# EAGLE design M1553io (EAGLE 9.0.0)
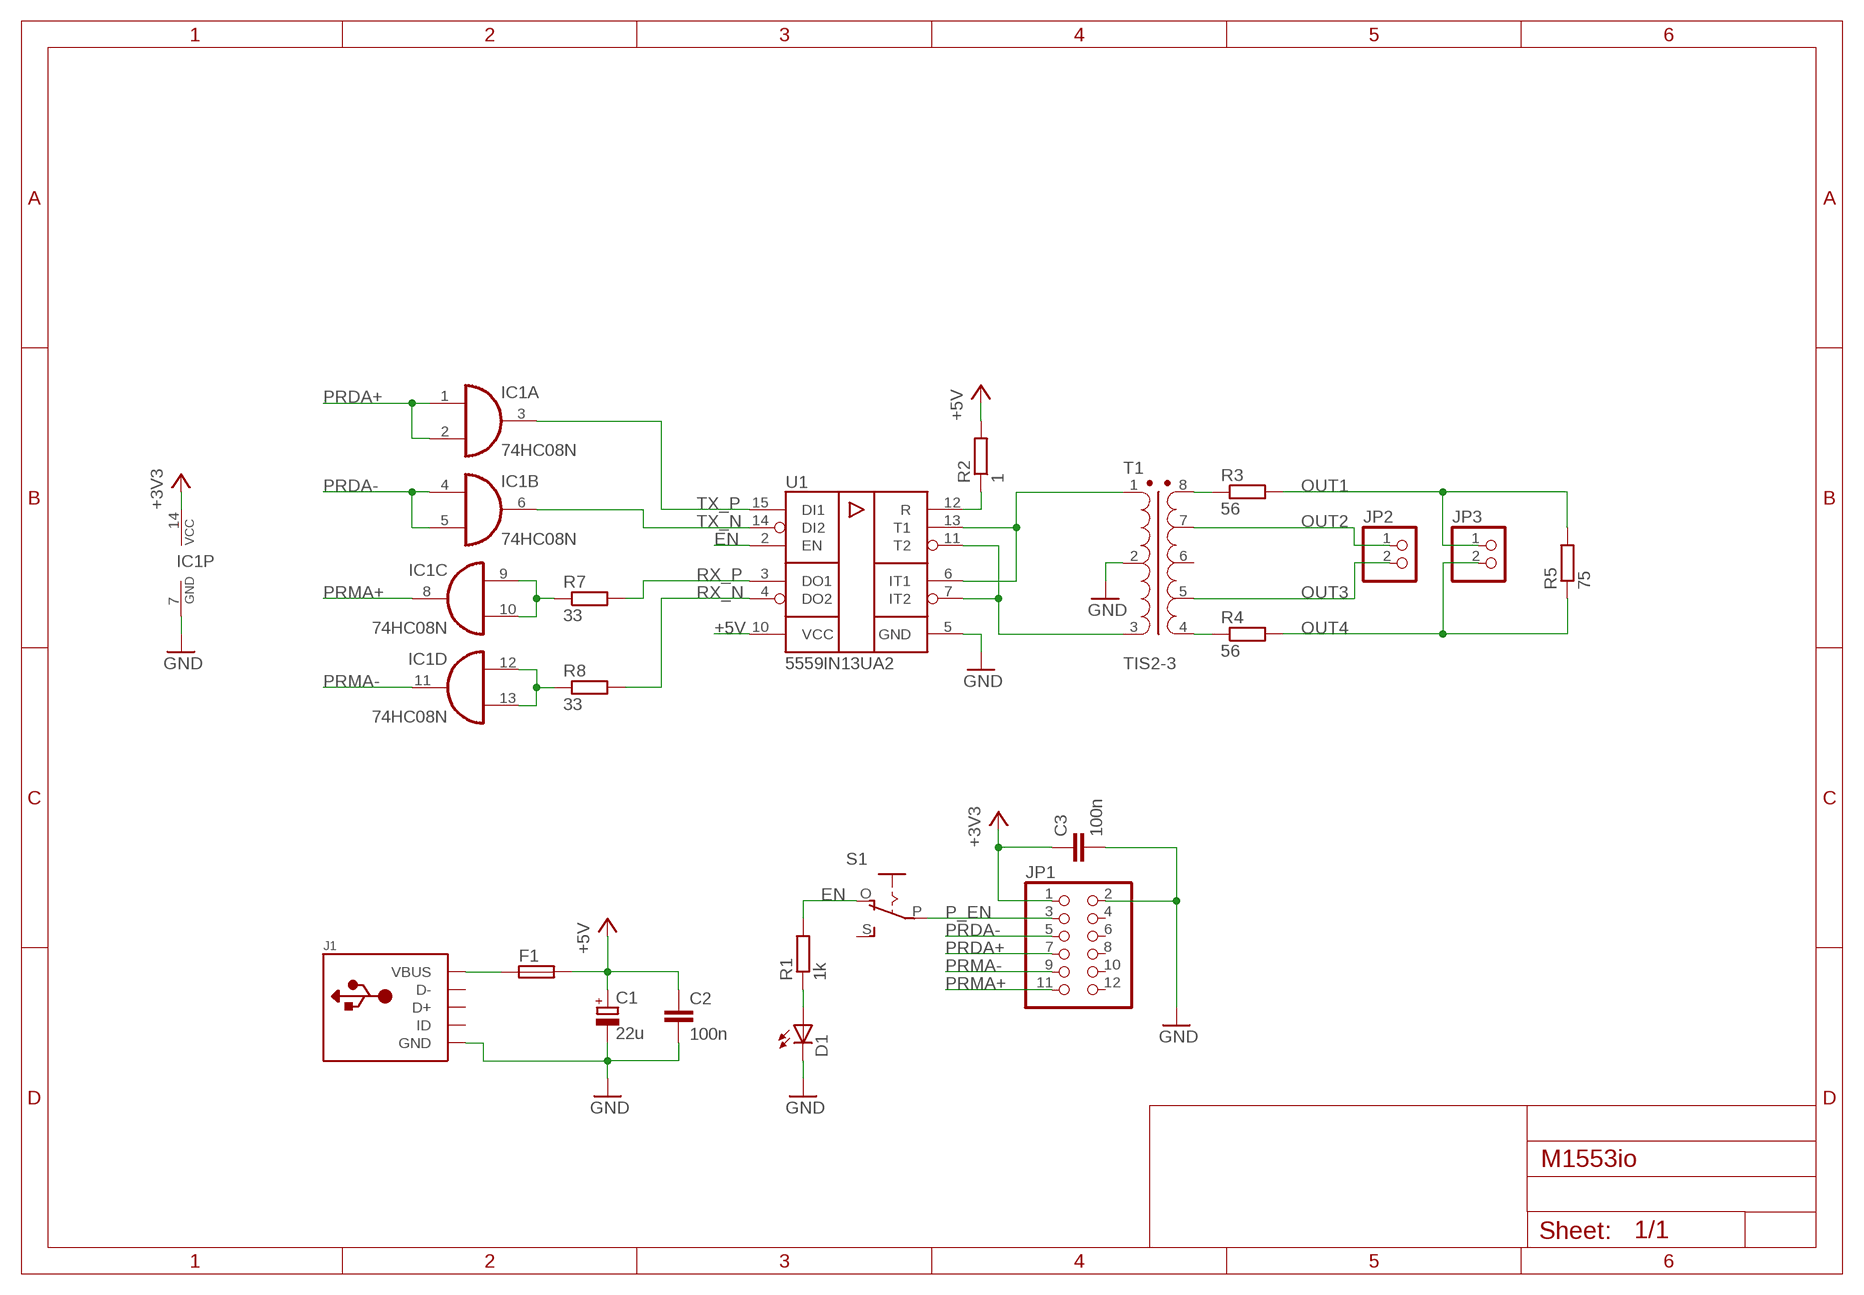
[diagram p0: schematic, sheet 1]

## Parts
C1  22u  CPOL-EU  [RCL-1206F-POL]
C2  100n  C-EU1206  [RCL-1206F]
C3  100n  C-EU1206  [RCL-1206F]
D1  LED1206  [LED-1206F]
F1  FUSE-NSMF  [RCL-1206F]
IC1  74HC08N  [DIL14]
J1  USB-MINI  [USB-MINIB]
JP1  PINHD-2X6  [2X06]
JP2  PINHD-1X2  [1X02]
JP3  PINHD-1X2  [1X02]
R1  1k  R-EU0805  [RCL-0805F]
R2  1  R-EU0805  [RCL-0805F]
R3  56  R-EU0805  [RCL-0805F]
R4  56  R-EU0805  [RCL-0805F]
R5  75  R-EU0805  [RCL-0805F]
R7  33  R-EU0805  [RCL-0805F]
R8  33  R-EU0805  [RCL-0805F]
S1  EG1218S  [EG1218]
T1  TIS2-3  [TIS2-3]
U1  5559IN13UA2  [5119.16-A]

## Nets
+3V3: C3.1 IC1.14(P:VCC) JP1.1
+5V: C1.+ C2.1 F1.2 R2.2 U1.10(VCC)
EN: R1.2 S1.O U1.2(EN)
GND: C1.- C2.2 C3.2 D1.C IC1.7(P:GND) J1.GND JP1.2 T1.2 U1.5(GND)
N$1: R3.1 T1.8
N$2: R4.1 T1.4
N$3: R2.1 U1.12(R)
N$14: F1.1 J1.VBUS
N$15: D1.A R1.1
N$16: IC1.9(C:I0) IC1.10(C:I1) R7.1
N$18: IC1.12(D:I0) IC1.13(D:I1) R8.1
OUT1: JP3.1 R3.2 R5.2
OUT2: JP2.1 T1.7
OUT3: JP2.2 T1.5
OUT4: JP3.2 R4.2 R5.1
P_EN: JP1.3 S1.P
PRDA+: IC1.1(A:I0) IC1.2(A:I1) JP1.7
PRDA-: IC1.4(B:I0) IC1.5(B:I1) JP1.5
PRMA+: IC1.8(C:O) JP1.11
PRMA-: IC1.11(D:O) JP1.9
RX_N: R8.2 U1.4(DO2)
RX_P: R7.2 U1.3(DO1)
T1: T1.1 U1.6(IT1) U1.13(T1)
T2: T1.3 U1.7(IT2) U1.11(T2)
TX_N: IC1.6(B:O) U1.14(DI2)
TX_P: IC1.3(A:O) U1.15(DI1)
Unconnected: J1.D+ J1.D- J1.ID JP1.4 JP1.6 JP1.8 JP1.10 JP1.12 S1.S T1.6

## Library data of the parts
C1 = MakBit:CPOL-EU: Polarized capacitor Tantalum SMD 3215, Electrolytic D: 5mm (10uF 50V), 6mm (100uF 9V), 7mm, 10mm (10uF 400V), 13mm (22uF 400V)
C2 C3 = MakBit:C-EU: SMD & PTH Capacitor
D1 = MakBit:LED: LEDs Standard schematic elements and footprints for 5mm, 3mm, 1206 LEDs.
F1 = MakBit:FUSE-NSMF: Bourns MF-NSMF Series - PRC Resettable Fuses USB port protection - USB 2.0, 3.0 HDMI 1.4 Source protection PC motherboards - Plug and Play protection Mobile phones - Battery and port protection PDAs / digital cameras
IC1 = 74xx-eu:74*08: Quad 2-input AND gate
J1 = MakBit:USB-MINI: USB Mini-B SMD Connector
JP1 = pinhead:PINHD-2X6: PIN HEADER
JP2 JP3 = pinhead:PINHD-1X2: PIN HEADER
R1-R5 R7 R8 = MakBit:R-EU: SMD & Through-hole Resistor
S1 = MakBit:EG1218: SLIDING SWITCH 0.1" spacing through hole, vertical SPDT slide switch http://www.ladyada.net/library/pcb/eaglelibrary.html
T1 = 5559:TIS2-3: Transformer TIS2-3 ТИС предназначен для применения в системах передачи данных и информации на базе стандартных интерфейсов цифровых сетей по ГОСТ Р 52070-2003 (MIL_STD_1553). More info here <http://mstator.ru/products/pulse_transformers/tis>
U1 = 5559:5559IN13UA2: 5559ИН13УА2

## Board
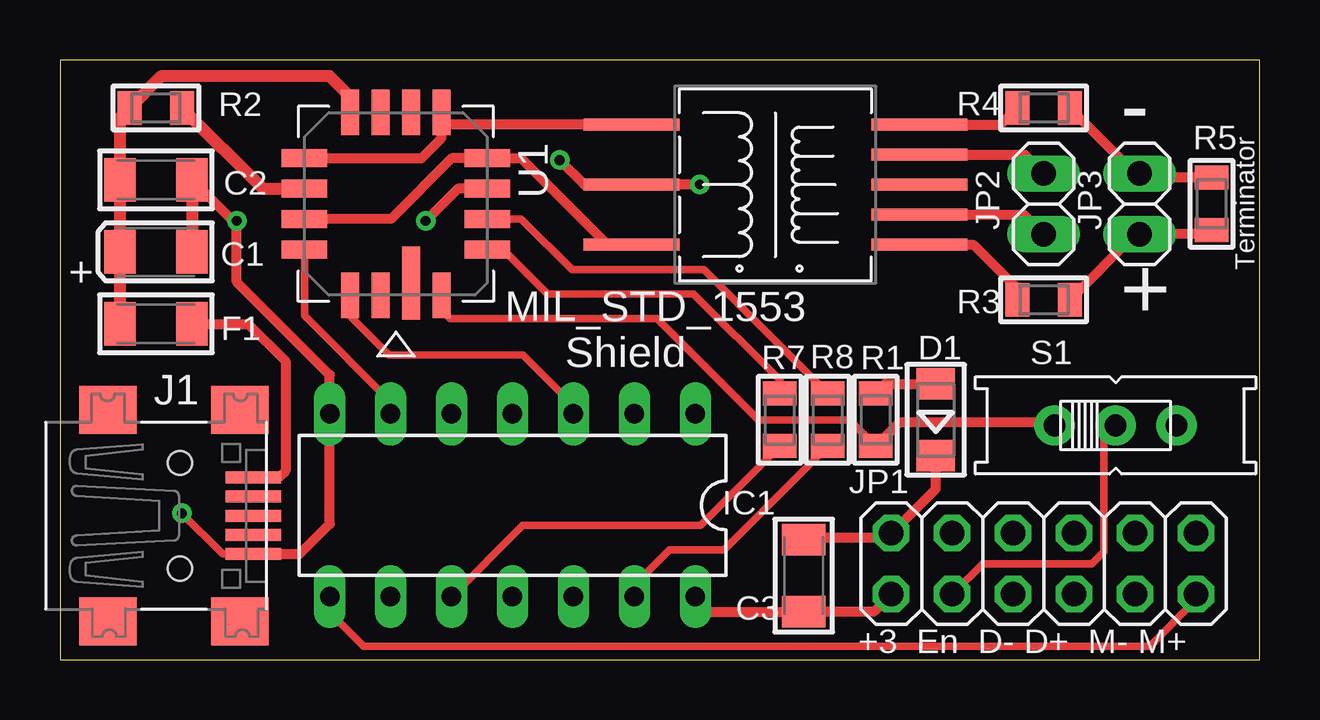
[diagram p1: board, top side]
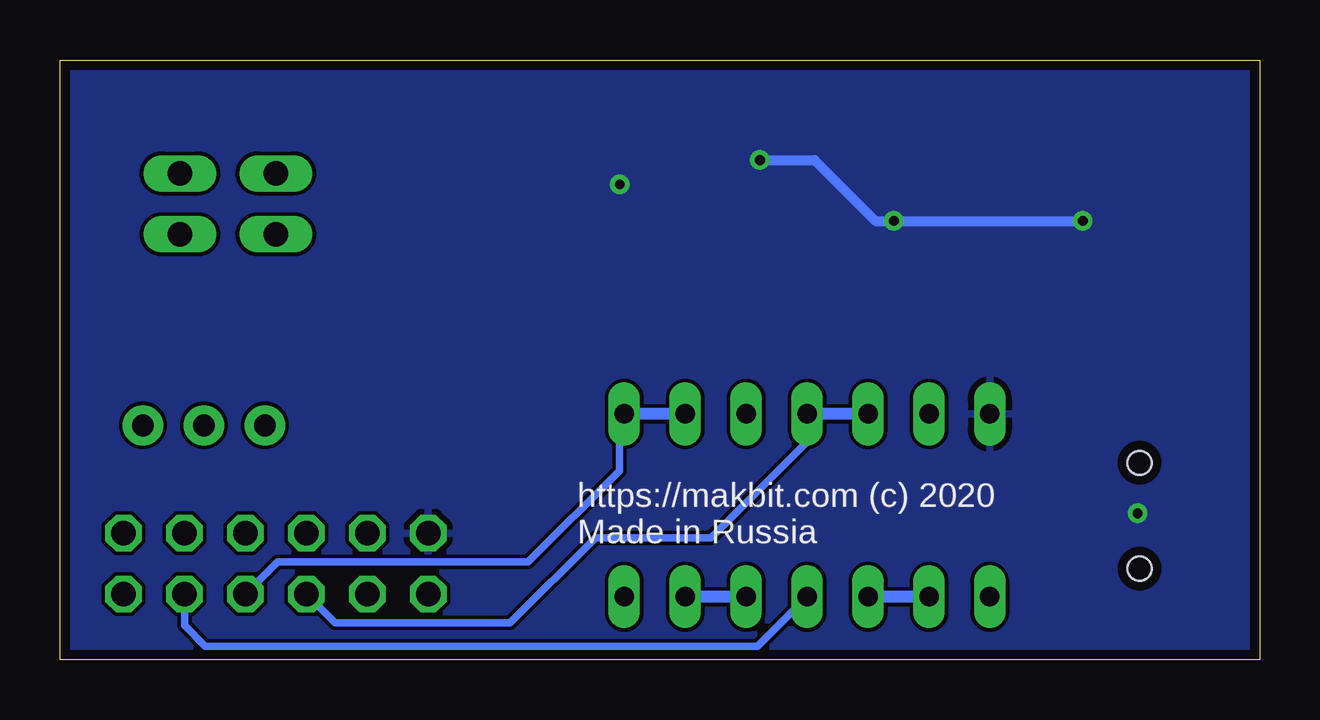
[diagram p2: board, bottom side, seen from below]

Size 50 x 25 mm. Coordinates in mm from the lower left corner, seen from the top.
Outline: 0,0 50,0 50,25 0,25 0,0
Copper layers (1*16): Top 0.035mm / dielectric 1.5mm / Bottom 0.035mm
Design rules "default *": minimum track width 6mil, minimum drill 0.35mm, track to track 6mil, track to pad 6mil, pad to pad 6mil, via to via 6mil, smd to smd 6mil, copper to edge 16mil, drill to drill 8mil, minimum pad ring 10mil, minimum via ring 8mil, stop-mask expansion 4mil, vias tented up to drill 17mil, thermal gap 10mil

### Footprints (pad centres in the part's own frame; a part is rotated, then mirrored left to right if it is on the bottom)
RCL-1206F-POL = smd 1.3 x 1.8: + 1.5,0; - -1.5,0
RCL-1206F = smd 1.3 x 1.8: 1 -1.5,0; 2 1.5,0
LED-1206F = smd 1.3 x 1.6: A -1.5,0; C 1.5,0
DIL14 = drill 0.813 long: 1 -7.62,-3.81; 2 -5.08,-3.81; 3 -2.54,-3.81; 4 0,-3.81; 5 2.54,-3.81; 6 5.08,-3.81; 7 7.62,-3.81; 8 7.62,3.81; 9 5.08,3.81; 10 2.54,3.81; 11 0,3.81; 12 -2.54,3.81; 13 -5.08,3.81; 14 -7.62,3.81
USB-MINIB = smd 0.5 x 2.308: D+ 0,4.064; D- -0.8,4.064; GND 1.6,4.064; ID 0.8,4.064; VBUS -1.6,4.064 | smd 2 x 2.4: GND1 -4.4,-2; GND2 -4.4,3.5; GND3 4.4,3.5; GND4 4.4,-2 | hole 1: -2.2,1; 2.2,1
2X06 = drill 1.016 octagon: 1 -6.35,-1.27; 2 -6.35,1.27; 3 -3.81,-1.27; 4 -3.81,1.27; 5 -1.27,-1.27; 6 -1.27,1.27; 7 1.27,-1.27; 8 1.27,1.27; 9 3.81,-1.27; 10 3.81,1.27; 11 6.35,-1.27; 12 6.35,1.27
1X02 = drill 1.016 long: 1 -1.27,0; 2 1.27,0
RCL-0805F = smd 1 x 1.4: 1 -1.1,0; 2 1.1,0
EG1218 = drill 0.9 pad 1.676: O -2.54,0; P 0,0; S 2.54,0
TIS2-3 = smd 4 x 0.5: 1 -6,-2.5; 2 -6,0; 3 -6,2.5; 4 6,2.5; 5 6,1.25; 6 6,0; 7 6,-1.25; 8 6,-2.5
5119.16-A = smd 3.048 x 0.762: 1 3.302,0.635 | smd 1.905 x 0.762: 2 3.81,1.905; 7 -3.81,1.905; 8 -3.81,0.635; 9 -3.81,-0.635; 10 -3.81,-1.905; 15 3.81,-1.905; 16 3.81,-0.635 | smd 0.762 x 1.905: 3 1.905,3.81; 4 0.635,3.81; 5 -0.635,3.81; 6 -1.905,3.81; 11 -1.905,-3.81; 12 -0.635,-3.81; 13 0.635,-3.81; 14 1.905,-3.81

### Placement (x,y rotation side)
C1  4,17 180 top
C2  4,20 0 top
C3  31,3.5 90 top
D1  36.5,10 270 top
F1  4,14 180 top
IC1  18.86,6.43 180 top
J1  4,6 270 top
JP1  41,4 0 top
JP2  41,19 90 top
JP3  45,19 90 top
R1  34,10 270 top
R2  4,23 180 top
R3  41,15 0 top
R4  41,23 0 top
R5  48,19 270 top
R7  30,10 90 top
R8  32,10 90 top
S1  44,9.76 0 top
T1  29.82,19.8 0 top
U1  14,19 270 top

### Tracks (layer width: path | path; a pad name or v marks a point on that pad's centre or on a via)
+3V3
  Top 0.406: IC1.14 27.1,2 C3.1 33.92,2 JP1.1
+5V
  Top 0.508: F1.2 C1.+ C2.1 2.5,22.6 R2.2 4.24,24.34 11.22,24.34 12.1,23.46 U1.10
EN
  Top 0.305: R1.2 32.9,10 29.12,10 24.89,14.22 16.26,14.22 15.9,14.57 U1.2
  Top 0.406: R1.2 35.01,9.91 41.32,9.91 S1.O
GND  (via drill 0.41)
  Top 0.305: J1.GND 6.78,4.4 v5.08,6.1
  Top 0.406: 17.98,19.8 U1.5 16.59,19.64 v15.24,18.29 | J1.GND 9.99,4.4 11.24,5.65 IC1.7 11.24,11.87 7.37,15.75 v7.37,18.29 7.21,18.29 C2.2 | v20.83,20.83 21.86,19.8 T1.2 23.83,19.81 v26.67,19.81 | C3.2 31,5.08 | 31,5.08 31,5.35 | 31,5.08 34.46,5.08 JP1.2 36.5,7.12 D1.C
  Top 0.508: C2.2 C1.-
  Bottom 0.406: v7.37,18.29 v15.24,18.29 16,18.29 18.54,20.83 v20.83,20.83
  pour Bottom: 0,24.89 0,0 50.04,0 50.04,24.89
N$1
  Top 0.406: T1.8 38.07,17.3 39.9,15.47 R3.1
N$2
  Top 0.406: T1.4 39.2,22.3 R4.1
N$3
  Top 0.508: R2.1 8.46,19.64 U1.12
N$14
  Top 0.406: J1.VBUS 8.08,7.62 9.14,7.62 9.4,7.87 9.4,12.45 7.84,14 F1.1
N$15
  Top 0.406: R1.1 34.4,11.5 D1.A
N$16
  Top 0.305: R7.1 26.69,5.59 19.29,5.59 IC1.10
  Bottom 0.508: IC1.9 IC1.10
N$18
  Top 0.305: R8.1 27.67,4.57 25.4,4.57 23.94,3.11 IC1.13
  Bottom 0.508: IC1.12 IC1.13
OUT1
  Top 0.406: R3.2 44.83,17.73 JP3.1 47.83,17.73 R5.2
OUT2
  Top 0.406: T1.7 40.18,18.55 JP2.1
OUT3
  Top 0.406: T1.5 40.22,21.05 JP2.2
OUT4
  Top 0.406: R4.2 44.83,20.27 JP3.2 45.17,20.1 R5.1
P_EN
  Top 0.305: JP1.3 38.46,4 43,4 43.5,4.5 43.5,9.26 S1.P
PRDA+
  Bottom 0.305: IC1.1 26.67,10.05 26.67,7.87 30.48,4.06 40.94,4.06 JP1.7
  Bottom 0.508: IC1.2 IC1.1
PRDA-
  Bottom 0.305: IC1.4 18.86,9.08 22.86,5.08 27.69,5.08 31.24,1.52 38.52,1.52 JP1.5
  Bottom 0.508: IC1.5 IC1.4
PRMA+
  Top 0.305: IC1.8 11.24,1.97 12.65,0.56 45.42,0.56 47.35,2.49 JP1.11
PRMA-
  Bottom 0.305: IC1.11 20.92,0.56 43.43,0.56 43.94,0.56 44.81,1.43 JP1.9
RX_N
  Top 0.305: R8.2 26.84,16.26 21.34,16.26 19.23,18.36 U1.4
RX_P
  Top 0.305: R7.2 30,11.66 26.42,15.24 20.32,15.24 18.46,17.09 U1.3
T1
  Top 0.406: T1.1 22.83,17.3 19.23,20.91 U1.6 16.33,20.91 13.79,18.36 U1.13
T2
  Top 0.406: T1.3 16.2,22.3 16,22.1 15.9,22.2 | 15.9,22.2 15.9,22.35 U1.7 | U1.11 15.06,20.91 15.9,21.75 15.9,22.2
TX_N
  Top 0.305: U1.14 10.19,14.34 13.78,10.75 IC1.6
TX_P
  Top 0.305: U1.15 12.1,14.32 13.72,12.7 19.3,12.7 21.4,10.6 IC1.3

### Text on the board
tNames: - | Terminator | + | MIL_STD_1553 / Shield | +3 En D- D+ M- M+
bNames: https://makbit.com (c) 2020 / Made in Russia